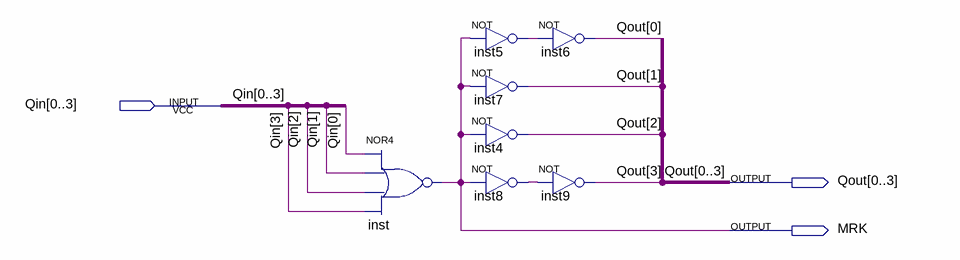
[diagram p0: schematic sheet]
// Quartus schematic MRK_equally_ZERO.bdf as structural Verilog: 7 symbols, 3 pins
module MRK_equally_ZERO (
  input  [0:3] Qin,
  output [0:3] Qout,
  output MRK
);

  wire inst5_out, inst8_out;

  nor inst (MRK, Qin[0], Qin[1], Qin[2], Qin[3]);
  not inst5 (inst5_out, MRK);
  not inst7 (Qout[1], MRK);
  not inst4 (Qout[2], MRK);
  not inst8 (inst8_out, MRK);
  not inst6 (Qout[0], inst5_out);
  not inst9 (Qout[3], inst8_out);
endmodule
